# Altium schematic sheet Error_Generator.SchDoc
size A; SheetNumber: 2; SheetTotal: 6
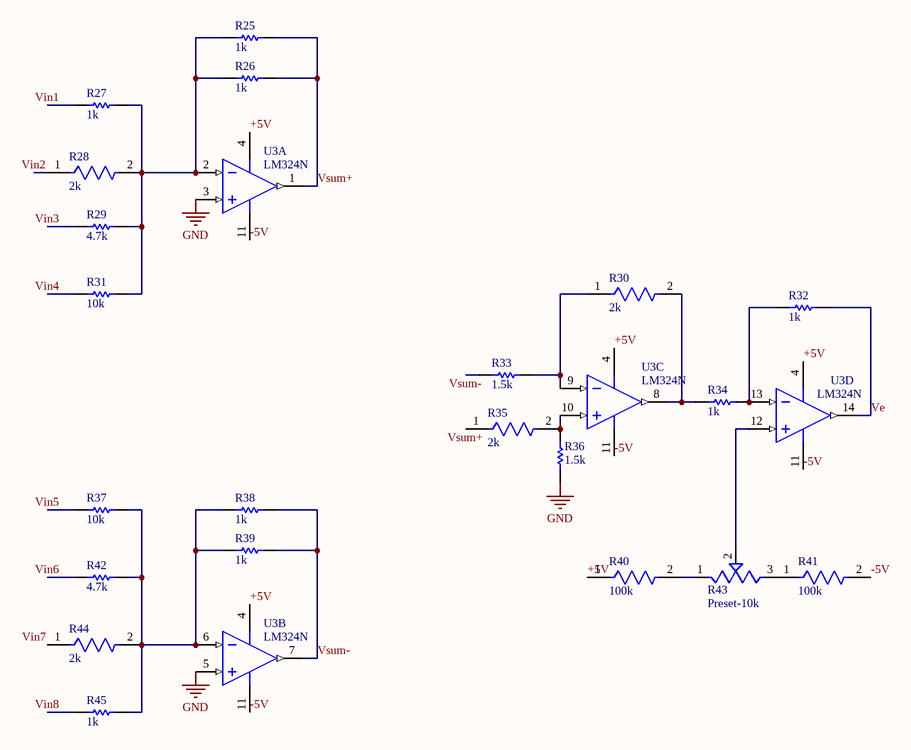
[diagram p0: Error_Generator.SchDoc]

## Parts
R25  1k  [RESC2013X60X35ML10T20]
R26  1k  [RESC2013X60X35ML10T20]
R27  1k  [RESC2013X60X35ML10T20]
R28  2k  [FP-CRCW0805-e3-IPC_B]
R29  4.7k  [YAGO-RC0805_M]
R30  2k  [FP-CRCW0805-e3-IPC_B]
R31  10k  [RESC2013X60X35NL10T20]
R32  1k  [RESC2013X60X35ML10T20]
R33  1.5k  [RESC2013X60X35LL10T20]
R34  1k  [RESC2013X60X35ML10T20]
R35  2k  [FP-CRCW0805-e3-IPC_B]
R36  1.5k  [RESC2013X60X35LL10T20]
R37  10k  [RESC2013X60X35NL10T20]
R38  1k  [RESC2013X60X35ML10T20]
R39  1k  [RESC2013X60X35ML10T20]
R40  100k  [FP-RC0805-0_6-IPC_C]
R41  100k  [FP-RC0805-0_6-IPC_C]
R42  4.7k  [YAGO-RC0805_M]
R43  Preset-10k  [TRIM_3306F-1-103]
R44  2k  [FP-CRCW0805-e3-IPC_B]
R45  1k  [RESC2013X60X35ML10T20]
U3  LM324N  [N0014A]  (parts A,B,C,D of 4)

## Nets
GND: R36.1 U3.3(IN1+) U3.5(IN2+)
+5V: R40.1 U3.4(V+)
-5V: R41.2 U3.11(GND)
Ve: R32.2 U3.14(OUT4)
Vin1: R27.1
Vin2: R28.1
Vin3: R29.1
Vin4: R31.1
Vin5: R37.1
Vin6: R42.1
Vin7: R44.1
Vin8: R45.1
Vsum+: R25.2 R26.2 R35.1 U3.1(OUT1)
Vsum-: R33.1 R38.2 R39.2 U3.7(OUT2)
NetR25_1: R25.1 R26.1 R27.2 R28.2 R29.2 R31.2 U3.2(IN1-)
NetR30_1: R30.1 R33.2 U3.9(IN3-)
NetR30_2: R30.2 R34.1 U3.8(OUT3)
NetR32_1: R32.1 R34.2 U3.13(IN4-)
NetR35_2: R35.2 R36.2 U3.10(IN3+)
NetR37_2: R37.2 R38.1 R39.1 R42.2 R44.2 R45.2 U3.6(IN2-)
NetR40_2: R40.2 R43.1(CCW)
NetR41_1: R41.1 R43.3(CW)
NetR43_2: R43.2(W) U3.12(IN4+)

## Library data of the parts
R25-R27 R32 R34 R38 R39 R45 = 1k: Chip Resistor, 1 KOhm, +/- 1%, 125 mW, -55 to 155 degC, 0805 (2012 Metric), RoHS, Tape and Reel; RC0805FR-071KL; Manufacturer: Yageo; Temperature Coefficient: 100ppm/degreesC; Voltage Rating (DC): 150V; Max Power Dissipation: 125mW; Resistance: 1KOhm; Number of Pins: 2; Number of Terminations: 2; Datasheet URL: http://www.yageo.com/NewPortal/yageodocoutput?fileName=/pdf/R-Chip/PYu-RC_Group_51_RoHS_L_5.pdf; Length: 0.079inch; Package Description: 2-Pin Surface Mounted Device, Body 2 x 1.25 mm; Depth: 1.25mm; Height: 0.024inch; Military Standard: Not; Case/Package: 0805; Package Reference: 0805; RoHSCompliant: true; Lead Free: LeadFree; Packaging: TapeandReel; Package Quantity: 1; Datasheet Version: Rev. 5, 10/2016; Tolerance: 1%; Min Operating Temperature: -55degC; Voltage Rating: 150V; Composition: ThickFilm; Case Code (Imperial): 0805; Power Rating: 125mW; Width: 0.049inch; Case Code (Metric): 2012; Manufacturer URL: http://www.yageo.com/; Max Operating Temperature: 155degC; REACH SVHC: Unknown; Termination: SMD/SMT
R28 R30 R35 R44 = 2k: RES Thick Film, 2kΩ, 1%, 0.125W, 100ppm/°C, 0805; CRCW08052K00FKEA; Working Voltage: 150V; Max Power Dissipation: 125mW; Resistance: 2kR; Package Quantity: 10; Case Code (Metric): 2012; Voltage Rating: 150V; Number of Terminations: 2; Max Operating Temperature: 155°C; Depth: 1.25mm; Tolerance: 1%; Power Rating: 125mW; Lead Free: Lead Free; Case/Package: 0805; Features: Automotive AEC-Q200; Min Operating Temperature: -55°C; Termination: SMD/SMT; Case Code (Imperial): 0805; Weight: 0.000194oz; Packaging: Tape and Reel; Military Standard: Not; Radiation Hardening: No; Contact Plating: Tin; Mount: Surface Mount; Temperature Coefficient: 100ppm/°C; Height: 0.02inch; Number of Terminals: 2; Voltage Rating (DC): 150V; Number of Pins: 2; Length: 2mm; Width: 1.25mm; Composition: Thick Film
R29 R42 = 4.7k: General Puprose Chip Resistor, 4700 Ohm +/- 1%, 0.125 W, -55 to 155 degC, 2-Pin SMD, RoHS, Tape and Reel; RC0805FR-074K7L; Tolerance: +/- 1%; Power: 0.125 W; PackageDescription: 2-Pin Surface Mount Device, Body 2 x 1.25 mm; ComponentLink2URL: http://www.yageo.com/documents/recent/PYu-RC_Group_51_RoHS_L-3.pdf; Temperature Min: -55 degC; Packing: Tape and Reel; Mounting Technology: Surface Mount; PartNumber: RC0805FR-074K7L; ComponentLink1URL: http://www.yageo.com/NewPortal/_en/index.jsp; Resistance: 4700 Ohm; Temperature Max: 155 degC; ComponentLink2Description: Datasheet; DatasheetVersion: Rev. 3; RoHS: TRUE; ComponentLink1Description: Manufacturer URL
R31 R37 = 10k: Chip Resistor, 10 KOhm, +/- 1%, 0.125 W, -55 to 155 degC, 0805 (2012 Metric), RoHS, Tape and Reel; RC0805FR-0710KL; Manufacturer: Yageo; Voltage Rating: 150 V; Mount: Surface Mount; ComponentLink1Description: Manufacturer URL; ComponentLink2URL: http://www.yageo.com/documents/recent/PYu-RC_Group_51_RoHS_L_04.pdf; Pins: 2; Length: 2 mm; Min Operating Temperature: -55 degC; Height: 0.5 mm; Mounting Technology: Surface Mount; RoHSCompliant: true; REACH SVHC: No SVHC; ComponentLink1URL: http://www.yageo.com/; Max Operating Temperature: 155 degC; PackageReference: 0805; DatasheetVersion: Rev. 4, 02/2016; Package Quantity: 5000; Packaging: Tape and Reel; ComponentLink2Description: Datasheet; PackageDescription: 2-Pin Surface Mounted Device, Body 2 x 1.25 mm
R33 R36 = 1.5k: RES 1.50K OHM 1/8W 1% 0805 SMD; RC0805FR-071K5L; Manufacturer: Yageo; PackageReference: 0805; ComponentLink1URL: http://www.yageo.com/documents/recent/PYu-RC_Group_51_RoHS_L_04.pdf; ComponentLink1Description: Datasheet; PartNumber: RC0805FR-071K5L
R40 R41 = 100k: RES 100K OHM 1% 1/8W 0805; RC0805FR-07100KL; Power Rating: 125mW; Temperature Coefficient: 100ppm/°C; Voltage Rating (DC): 150V; Resistance: 100kR; Package Quantity: 1; Case/Package: 0805; Lead Pitch: 0.4mm; Case Code (Imperial): 0805; Construction: Rectangular; Number of Terminations: 2; RoHS Compliant: Yes; Max Power Dissipation: 125mW; Tolerance: 1%; Max Operating Temperature: 155°C; Resistance Tolerance: 1%; Lead Free: Lead Free; Packaging: Tape and Reel; Resistor Type: Thick Film; Min Operating Temperature: -55°C; Case Code (Metric): 2012; Series: RC; Technology: THICK FILM; Voltage Rating: 150V; Termination: SMD/SMT; Width: 0.049inch; Number of Pins: 2; Features: Moisture Resistant; Military Standard: Not; Length: 0.079inch; Depth: 1.25mm; Size Code: 0805; Height: 0.024inch
R43 = Preset: TRIMMER - 6MM ROUND, SINGLE-TURN,CERMET, 10K OHMS | Bourns 3306F-1-103; SnapEDA_Link: https://www.snapeda.com/parts/3306F-1-103/Bourns/view-part/?ref=snap; Package: 3306F Bourns; Value: *; MF: Bourns; MP: 3306F-1-103; Check_prices: https://www.snapeda.com/parts/3306F-1-103/Bourns/view-part/?ref=eda
U3 = LM324N: Low Power Quad Operational Amplifier, 14-pin MDIP; Manufacturer: Texas Instruments; CompType: Amplifiers; PowerWise: N; PackageTopMarking: NSUZXYYTTE#*LM324N; PackageDescription: MDIP, .750 x .250 x.130in, 14 Lead, .100in Pitch; Package Reference: N0014A; RoHS: N; Code_JEDEC: MS-001-AA; ComponentLink1URL: http://www.ti.com/general/docs/lit/getliterature.tsp?genericPartNumber=LM324&fileType=pdf; ComponentLink1Description: Datasheet URL; PinCount: 14